# Altium project SNA.PrjPcb
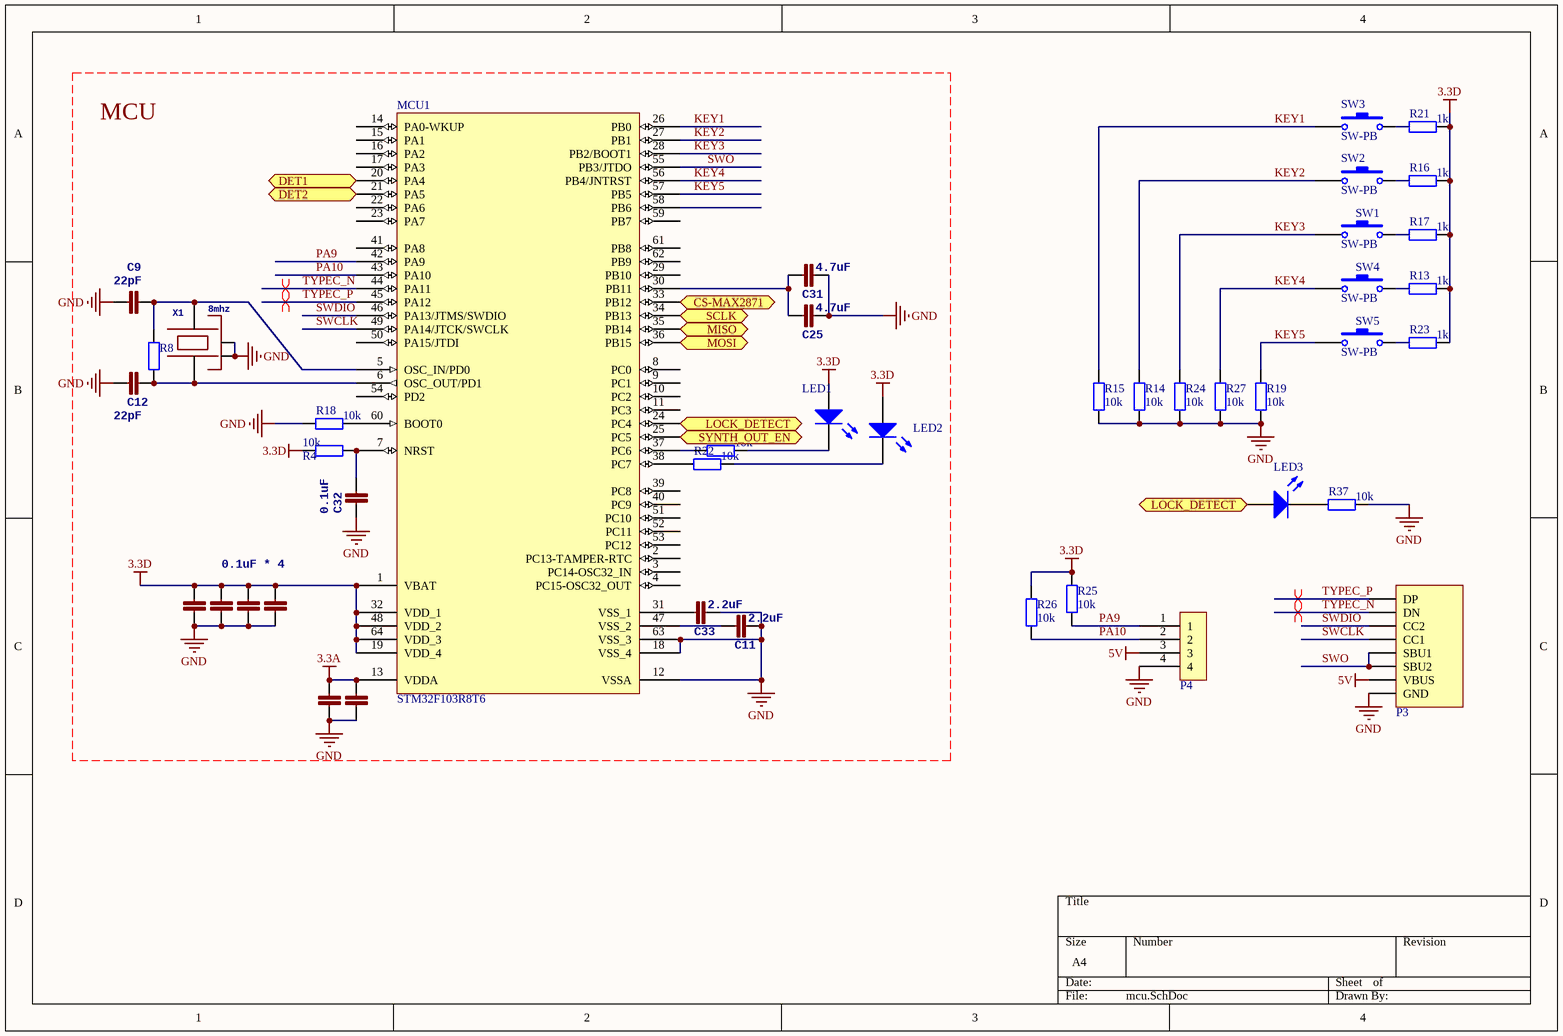
[diagram p0: mcu.SchDoc]
4 sheets, 135 parts. Net scope: flat (ports and power ports of the same name join across sheets).
Board file: SNA.PcbDoc
Sheets:
  mcu.SchDoc
  Detector.SchDoc
  source.SchDoc
  power.SchDoc

## Sheet mcu.SchDoc
size A4

### Parts
C3  1n  [0402]  (value not drawn)
C4  0.1uF * 4  [0402]
C5  1n  [0402]  (value not drawn)
C6  1n  [0402]  (value not drawn)
C7  1n  [0402]  (value not drawn)
C8  1n  [0402]  (value not drawn)
C9  22pF  [0402]
C11  2.2uF  [0603]
C12  22pF  [0402]
C25  4.7uF  [0603]
C31  4.7uF  [0603]
C32  0.1uF  [0402]
C33  2.2uF  [0603]
LED1  LED0  [0603]  (value not drawn)
LED2  LED0  [0603]  (value not drawn)
LED3  LED0  [0603]  (value not drawn)
MCU1  STM32F103R8T6  [LQFP64_N]
P3  USBC  [USBTC]  (value not drawn)
P4  UART/I2C  [4pSocket]  (value not drawn)
R4  10k  [0402]
R8  (no value)  [0402]
R13  1k  [0402]
R14  10k  [0402]
R15  10k  [0402]
R16  1k  [0402]
R17  1k  [0402]
R18  10k  [0402]
R19  10k  [0402]
R20  10k  [0402]
R21  1k  [0402]
R22  10k  [0402]
R23  1k  [0402]
R24  10k  [0402]
R25  10k  [0402]
R26  10k  [0402]
R27  10k  [0402]
R37  10k  [0402]
SW1  SW-PB  [SW3x4]
SW2  SW-PB  [SW3x4]
SW3  SW-PB  [SW3x4]
SW4  SW-PB  [SW3x4]
SW5  SW-PB  [SW3x4]
X1  8mhz  [OSCILLATOR-3.2X2.5]

### Ports
CS-MAX2871 (out), DET1, DET2, LOCK_DETECT, MISO, MOSI, SCLK (out), SYNTH_OUT_EN

### Nets
3.3A: C3.1 C8.1 MCU1.13(VDDA)
3.3D: C4.2 C5.2 C6.2 C7.2 LED1.1(A) LED2.1(A) MCU1.1(VBAT) MCU1.19(VDD_4) MCU1.32(VDD_1) MCU1.48(VDD_2) MCU1.64(VDD_3) R4.2 R13.2 R16.2 R17.2 R21.2 R23.2 R25.2 R26.2
5V: P3.VBUS P4.3
GND: C3.2 C4.1 C5.1 C6.1 C7.1 C8.2 C9.2 C11.2 C12.2 C25.2 C31.2 C32.1 C33.2 MCU1.12(VSSA) MCU1.18(VSS_4) MCU1.63(VSS_3) P3.GND P4.4 R14.1 R15.1 R18.1 R19.1 R24.1 R27.1 R37.2 X1.2(NC_2) X1.4(NC_4)
KEY1: MCU1.26(PB0) R15.2 SW3.1
KEY2: MCU1.27(PB1) R14.2 SW2.1
KEY3: MCU1.28(PB2/BOOT1) R24.2 SW1.1
KEY4: MCU1.56(PB4/JNTRST) R27.2 SW4.1
KEY5: MCU1.57(PB5) R19.2 SW5.1
PA9: MCU1.42(PA9) P4.1 R25.1
PA10: MCU1.43(PA10) P4.2 R26.1
SWCLK: MCU1.49(PA14/JTCK/SWCLK) P3.CC1
SWDIO: MCU1.46(PA13/JTMS/SWDIO) P3.CC2
SWO: MCU1.55(PB3/JTDO) P3.SBU1 P3.SBU2
TYPEC_N: MCU1.44(PA11) P3.DN
TYPEC_P: MCU1.45(PA12) P3.DP
NetC9_1: C9.1 MCU1.5(OSC_IN/PD0) R8.2 X1.3
NetC11_1: C11.1 MCU1.47(VSS_2)
NetC12_1: C12.1 MCU1.6(OSC_OUT/PD1) R8.1 X1.1
NetC25_1: C25.1 C31.1 MCU1.30(PB11)
NetC32_2: C32.2 MCU1.7(NRST) R4.1
NetC33_1: C33.1 MCU1.31(VSS_1)
NetLED1_2: LED1.2(K) R20.2
NetLED2_2: LED2.2(K) R22.2
NetLED3_1: LED3.1(A) MCU1.24(PC4) ; port LOCK_DETECT
NetLED3_2: LED3.2(K) R37.1
NetMCU1_20: MCU1.20(PA4) ; port DET1
NetMCU1_21: MCU1.21(PA5) ; port DET2
NetMCU1_25: MCU1.25(PC5) ; port SYNTH_OUT_EN
NetMCU1_33: MCU1.33(PB12) ; port CS-MAX2871
NetMCU1_34: MCU1.34(PB13) ; port SCLK
NetMCU1_35: MCU1.35(PB14) ; port MISO
NetMCU1_36: MCU1.36(PB15) ; port MOSI
NetMCU1_37: MCU1.37(PC6) R20.1
NetMCU1_38: MCU1.38(PC7) R22.1
NetMCU1_60: MCU1.60(BOOT0) R18.2
NetR13_1: R13.1 SW4.2
NetR16_1: R16.1 SW2.2
NetR17_1: R17.1 SW1.2
NetR21_1: R21.1 SW3.2
NetR23_1: R23.1 SW5.2

Not connected (* = marked no-connect by the designer): MCU1 2(PC13-TAMPER-RTC) 3(PC14-OSC32_IN) 4(PC15-OSC32_OUT) 8(PC0) 9(PC1) 10(PC2) 11(PC3) 14(PA0-WKUP) 15(PA1) 16(PA2) 17(PA3) 22(PA6) 23(PA7) 29(PB10) 39(PC8) 40(PC9) 41(PA8) 50(PA15/JTDI) 51(PC10) 52(PC11) 53(PC12) 54(PD2) 58(PB6) 59(PB7) 61(PB8) 62(PB9)

### Layout directives
differential pair: TYPEC_N, TYPEC_P

### Notes on the sheet
- MCU

### Library data of the parts
C3-C9 C11 C12 C25 C31-C33 = CAP0402-CAP: <b>Capacitor</b> / Standard 0603 ceramic capacitor, and 0.1" leaded capacitor.; PARTNO: CC0402ZRY5V7BB104
LED1-LED3 = LED0: Typical INFRARED GaAs LED; Published: 8-Jun-2000; LatestRevisionDate: 08-Jul-2005; LatestRevisionNote: Mech Layer 1 removed.; PackageReference: LED-0; Publisher: Altium Limited; PackageDescription: LED; 2 Leads
MCU1 = STM32F103R8T6: STM32 ARM-based 32-bit MCU with 64 Kbytes Flash, 64-pin LQFP, Industrial Temperature; Published: *; DatasheetVersion: *; PackageVersion: *; PackageReference: *; Publisher: *; PackageDescription: *; ComponentLink1Description: *; ComponentLink1URL: *; ComponentLink2Description: *; ComponentLink2URL: *
P4 = 4PSocket
R4 R8 R13-R27 R37 = Res2: Resistor; Value: 0Ohm; Published: 8-Jun-2000; LatestRevisionDate: 17-Jul-2002; LatestRevisionNote: Re-released for DXP Platform.; PackageReference: AXIAL-0.4; Publisher: Altium Limited; PackageDescription: Axial Device, Thru-Hole; 2 Leads; 0.4 in Pin Spacing
SW1-SW5 = SW-PB: Switch; Published: 24-Mar-1999; LatestRevisionDate: 17-Jul-2002; LatestRevisionNote: Re-released for DXP Platform.; PackageReference: SPST-2; Publisher: Altium Limited; PackageDescription: Switch; 2 Leads
X1 = OSCILLATOR-3.2X2.5: Crystal Oscillator in 3.2x2.5 SMD

## Sheet Detector.SchDoc
size A4
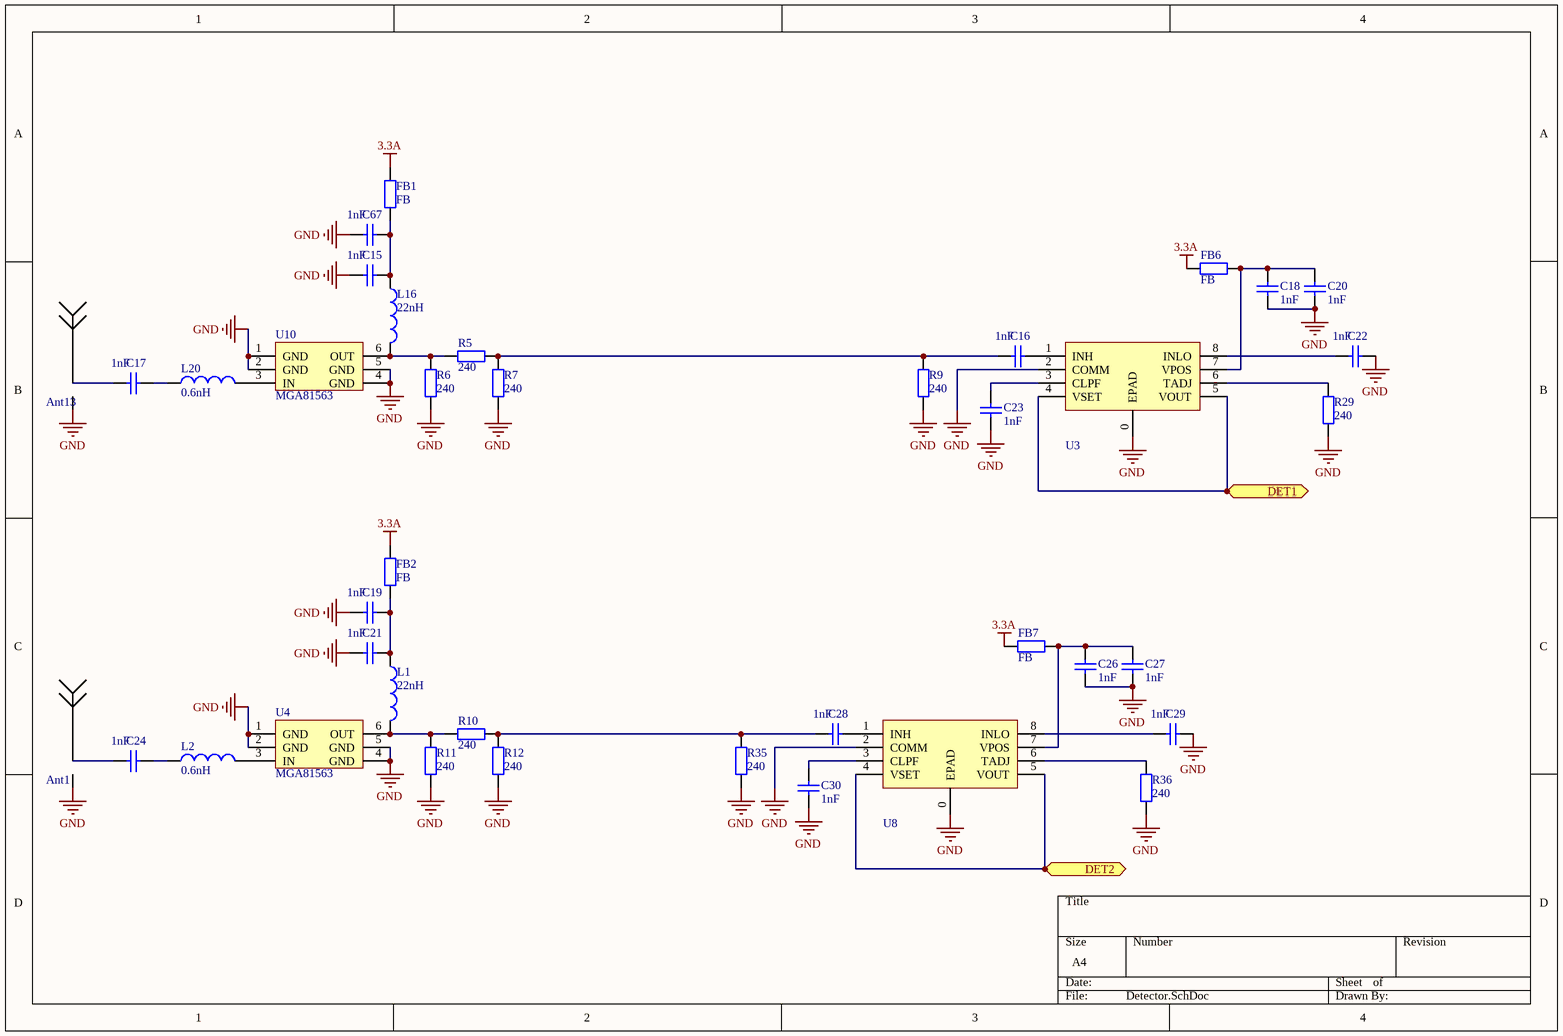
[diagram p1: Detector.SchDoc]

### Parts
Ant1  Antenna  [SMA-2]  (value not drawn)
Ant13  Antenna  [SMA-2]  (value not drawn)
C15  1nF  [0402]
C16  1nF  [0402]
C17  1nF  [0402]
C18  1nF  [0402]
C19  1nF  [0402]
C20  1nF  [0402]
C21  1nF  [0402]
C22  1nF  [0402]
C23  1nF  [0402]
C24  1nF  [0402]
C26  1nF  [0402]
C27  1nF  [0402]
C28  1nF  [0402]
C29  1nF  [0402]
C30  1nF  [0402]
C67  1nF  [0402]
FB1  FB  [0402]
FB2  FB  [0402]
FB6  FB  [0402]
FB7  FB  [0402]
L1  value 22nH  [0402]  (hidden comment: Inductor)
L2  value 0.6nH  [0402]  (hidden comment: Inductor)
L16  value 22nH  [0402]  (hidden comment: Inductor)
L20  value 0.6nH  [0402]  (hidden comment: Inductor)
R5  240  [0402]
R6  240  [0402]
R7  240  [0402]
R9  240  [0402]
R10  240  [0402]
R11  240  [0402]
R12  240  [0402]
R29  240  [0402]
R35  240  [0402]
R36  240  [0402]
U3  AD8319  [AD8319]  (value not drawn)
U4  MGA81563  [SC-70-6]
U8  AD8319  [AD8319]  (value not drawn)
U10  MGA81563  [SC-70-6]

### Ports
DET1, DET2

### Nets
3.3A: FB1.1 FB2.1 FB6.1 FB7.1
GND: Ant1.GND(G) Ant13.GND(G) C15.1 C18.1 C19.1 C20.1 C21.1 C22.2 C23.1 C26.1 C27.1 C29.2 C30.1 C67.1 R6.2 R7.2 R9.2 R11.2 R12.2 R29.2 R35.2 R36.2 U3.0(EPAD) U3.2(COMM) U4.1(GND) U4.2(GND) U4.4(GND) U4.5(GND) U8.0(EPAD) U8.2(COMM) U10.1(GND) U10.2(GND) U10.4(GND) U10.5(GND)
NetAnt1_1: Ant1.1 C24.1
NetAnt13_1: Ant13.1 C17.1
NetC15_2: C15.2 C67.2 FB1.2 L16.1
NetC16_1: C16.1 R5.2 R7.1 R9.1
NetC16_2: C16.2 U3.1(INH)
NetC17_2: C17.2 L20.1
NetC18_2: C18.2 C20.2 FB6.2 U3.7(VPOS)
NetC19_2: C19.2 C21.2 FB2.2 L1.1
NetC22_1: C22.1 U3.8(INLO)
NetC23_2: C23.2 U3.3(CLPF)
NetC24_2: C24.2 L2.1
NetC26_2: C26.2 C27.2 FB7.2 U8.7(VPOS)
NetC28_1: C28.1 R10.2 R12.1 R35.1
NetC28_2: C28.2 U8.1(INH)
NetC29_1: C29.1 U8.8(INLO)
NetC30_2: C30.2 U8.3(CLPF)
NetL1_2: L1.2 R10.1 R11.1 U4.6(OUT)
NetL2_2: L2.2 U4.3(IN)
NetL16_2: L16.2 R5.1 R6.1 U10.6(OUT)
NetL20_2: L20.2 U10.3(IN)
NetMCU1_20: U3.4(VSET) U3.5(VOUT) ; port DET1
NetMCU1_21: U8.4(VSET) U8.5(VOUT) ; port DET2
NetR29_1: R29.1 U3.6(TADJ)
NetR36_1: R36.1 U8.6(TADJ)

### Library data of the parts
C15-C24 C26-C30 C67 = Cap: Capacitor; Published: 8-Jun-2000; LatestRevisionDate: 17-Jul-2002; LatestRevisionNote: Re-released for DXP Platform.; PackageReference: RAD-0.3; Publisher: Altium Limited; PackageDescription: Radial Cap, Thru-Hole; 2 Leads; 0.3 in Pin Spacing
FB1 FB2 FB6 FB7 R5-R7 R9-R12 R29 R35 R36 = Res2: Resistor; Published: 8-Jun-2000; LatestRevisionDate: 17-Jul-2002; LatestRevisionNote: Re-released for DXP Platform.; PackageReference: AXIAL-0.4; Publisher: Altium Limited; PackageDescription: Axial Device, Thru-Hole; 2 Leads; 0.4 in Pin Spacing
L1 L2 L16 L20 = Inductor: Code_IEC: 1005; Published: 8-Jun-2000; LatestRevisionDate: 29-May-2009; LatestRevisionNote: IPC-7351 Footprint Added.; PackageReference: 0402-A; Publisher: Altium Limited; PackageDescription: Chip Inductor; Code_JEITA: 0402

## Sheet source.SchDoc
size A4
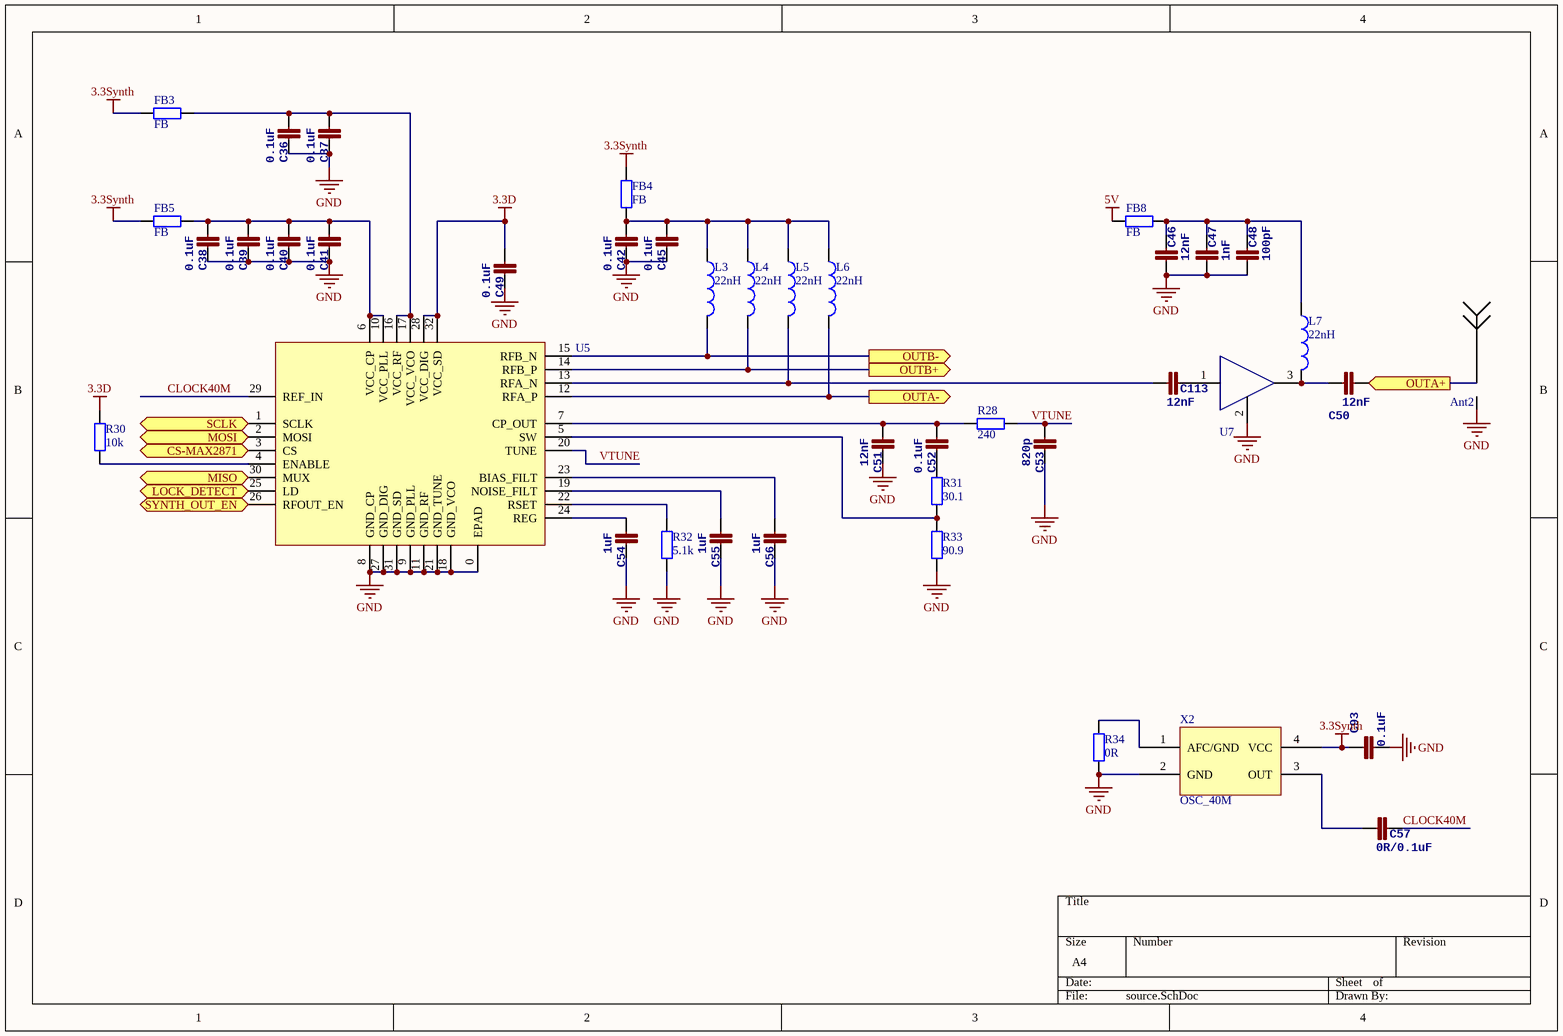
[diagram p2: source.SchDoc]

### Parts
Ant2  Antenna  [SMA-2]  (value not drawn)
C36  0.1uF  [0402]
C37  0.1uF  [0402]
C38  0.1uF  [0402]
C39  0.1uF  [0402]
C40  0.1uF  [0402]
C41  0.1uF  [0402]
C42  0.1uF  [0402]
C45  0.1uF  [0402]
C46  12nF  [0805]
C47  1nF  [0402]
C48  100pF  [0402]
C49  0.1uF  [0402]
C50  12nF  [0402]
C51  12nF  [0402]
C52  0.1uF  [0402]
C53  820p  [0402]
C54  1uF  [0402]
C55  1uF  [0402]
C56  1uF  [0402]
C57  0R/0.1uF  [0402]
C93  0.1uF  [0402]
C113  12nF  [0402]
FB3  FB  [0603]
FB4  FB  [0603]
FB5  FB  [0603]
FB8  FB  [0603]
L3  value 22nH  [0402]  (hidden comment: Inductor)
L4  value 22nH  [0402]  (hidden comment: Inductor)
L5  value 22nH  [0402]  (hidden comment: Inductor)
L6  value 22nH  [0402]  (hidden comment: Inductor)
L7  value 22nH  [0603]  (hidden comment: Inductor)
R28  240  [0402]
R30  10k  [0402]
R31  30.1  [0402]
R32  5.1k  [0402]
R33  90.9  [0402]
R34  0R  [0402]
U5  MAX2871  [MAX2871]  (value not drawn)
U7  AMP-SOT89  [SOT-89]  (value not drawn)
X2  OSC_40M  [TXC_7Q]

### Ports
CS-MAX2871 (in), LOCK_DETECT, MISO, MOSI, OUTA+ (out), OUTA- (out), OUTB+ (out), OUTB- (out), SCLK (in), SYNTH_OUT_EN

### Nets
3.3D: C49.1 R30.2 U5.28(VCC_DIG) U5.32(VCC_SD)
3.3Synth: C93.1 FB3.2 FB4.1 FB5.2 X2.4(VCC)
5V: FB8.1
GND: Ant2.GND(G) C36.2 C37.2 C38.2 C39.2 C40.2 C41.2 C42.2 C45.2 C46.1 C47.1 C48.1 C49.2 C51.2 C53.2 C54.2 C55.2 C56.2 C93.2 R32.1 R33.1 R34.2 U5.0(EPAD) U5.8(GND_CP) U5.9(GND_PLL) U5.11(GND_RF) U5.18(GND_VCO) U5.21(GND_TUNE) U5.27(GND_DIG) U5.31(GND_SD) U7.2 X2.2(GND)
CLOCK40M: C57.2 U5.29(REF_IN)
VTUNE: C53.1 R28.1 U5.20(TUNE)
NetAnt2_1: Ant2.1 C50.2 ; port OUTA+
NetC36_1: C36.1 C37.1 FB3.1 U5.16(VCC_RF) U5.17(VCC_VCO)
NetC38_1: C38.1 C39.1 C40.1 C41.1 FB5.1 U5.6(VCC_CP) U5.10(VCC_PLL)
NetC42_1: C42.1 C45.1 FB4.2 L3.1 L4.1 L5.1 L6.1
NetC46_2: C46.2 C47.2 C48.2 FB8.2 L7.1
NetC50_1: C50.1 L7.2 U7.3
NetC51_1: C51.1 C52.1 R28.2 U5.7(CP_OUT)
NetC52_2: C52.2 R31.2
NetC54_1: C54.1 U5.24(REG)
NetC55_1: C55.1 U5.19(NOISE_FILT)
NetC56_1: C56.1 U5.23(BIAS_FILT)
NetC57_1: C57.1 X2.3(OUT)
NetC113_1: C113.1 L5.2 U5.13(RFA_N)
NetC113_2: C113.2 U7.1
NetL3_2: L3.2 U5.15(RFB_N) ; port OUTB-
NetL4_2: L4.2 U5.14(RFB_P) ; port OUTB+
NetL6_2: L6.2 U5.12(RFA_P) ; port OUTA-
NetLED3_1: U5.25(LD) ; port LOCK_DETECT
NetMCU1_25: U5.26(RFOUT_EN) ; port SYNTH_OUT_EN
NetMCU1_33: U5.3(CS) ; port CS-MAX2871
NetMCU1_34: U5.1(SCLK) ; port SCLK
NetMCU1_35: U5.30(MUX) ; port MISO
NetMCU1_36: U5.2(MOSI) ; port MOSI
NetR30_1: R30.1 U5.4(ENABLE)
NetR31_1: R31.1 R33.2 U5.5(SW)
NetR32_2: R32.2 U5.22(RSET)
NetR34_1: R34.1 X2.1(AFC/GND)

### Library data of the parts
C36-C42 C45-C57 C93 C113 = CAP0402-CAP: as C3 on sheet mcu
FB3-FB5 FB8 R28 R30-R33 = Res2: Resistor; Published: 8-Jun-2000; LatestRevisionDate: 17-Jul-2002; LatestRevisionNote: Re-released for DXP Platform.; PackageReference: AXIAL-0.4; Publisher: Altium Limited; PackageDescription: Axial Device, Thru-Hole; 2 Leads; 0.4 in Pin Spacing
L3-L7 = Inductor: Code_IEC: 1005; Published: 8-Jun-2000; LatestRevisionDate: 29-May-2009; LatestRevisionNote: IPC-7351 Footprint Added.; PackageReference: 0402-A; Publisher: Altium Limited; PackageDescription: Chip Inductor; Code_JEITA: 0402
R34 = Res2: Resistor; Value: 0Ohm; Published: 8-Jun-2000; LatestRevisionDate: 17-Jul-2002; LatestRevisionNote: Re-released for DXP Platform.; PackageReference: AXIAL-0.4; Publisher: Altium Limited; PackageDescription: Axial Device, Thru-Hole; 2 Leads; 0.4 in Pin Spacing

## Sheet power.SchDoc
size A4
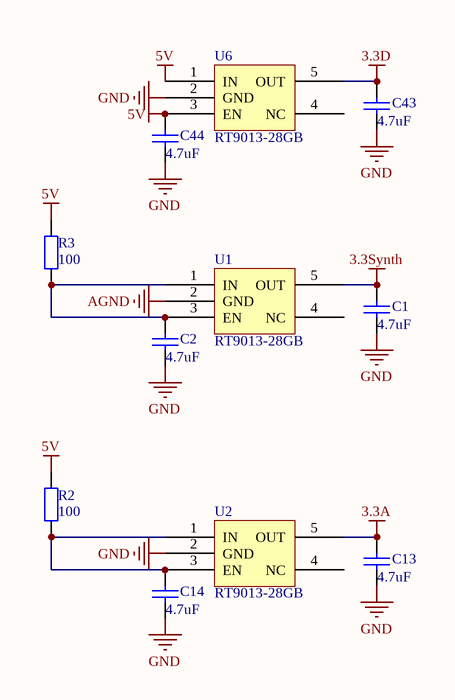
[diagram p3: power.SchDoc]

### Parts
C1  4.7uF  [0603]
C2  4.7uF  [0603]
C13  4.7uF  [0603]
C14  4.7uF  [0603]
C43  4.7uF  [0603]
C44  4.7uF  [0603]
R2  100  [0603]
R3  100  [0603]
U1  RT9013-28GB  [SOT23-5]
U2  RT9013-28GB  [SOT23-5]
U6  RT9013-28GB  [SOT23-5]

### Nets
3.3A: C13.2 U2.5(OUT)
3.3D: C43.2 U6.5(OUT)
3.3Synth: C1.2 U1.5(OUT)
5V: C44.2 R2.2 R3.2 U6.1(IN) U6.3(EN)
AGND: U1.2(GND)
GND: C1.1 C2.1 C13.1 C14.1 C43.1 C44.1 U2.2(GND) U6.2(GND)
NetC2_2: C2.2 R3.1 U1.1(IN) U1.3(EN)
NetC14_2: C14.2 R2.1 U2.1(IN) U2.3(EN)

Not connected (* = marked no-connect by the designer): U1 4(NC); U2 4(NC); U6 4(NC)

### Library data of the parts
C1 C2 C13 C14 C43 C44 = Cap: Capacitor; Published: 8-Jun-2000; LatestRevisionDate: 17-Jul-2002; LatestRevisionNote: Re-released for DXP Platform.; PackageReference: RAD-0.3; Publisher: Altium Limited; PackageDescription: Radial Cap, Thru-Hole; 2 Leads; 0.3 in Pin Spacing
R2 R3 = Res2: Resistor; Value: 0Ohm; Published: 8-Jun-2000; LatestRevisionDate: 17-Jul-2002; LatestRevisionNote: Re-released for DXP Platform.; PackageReference: AXIAL-0.4; Publisher: Altium Limited; PackageDescription: Axial Device, Thru-Hole; 2 Leads; 0.4 in Pin Spacing
U1 U2 U6 = LP5907

## Nets that join several sheets
3.3A: mcu (C3.1 C8.1 MCU1.13), Detector (FB1.1 FB2.1 FB6.1 FB7.1), power (C13.2 U2.5)
3.3D: mcu (19 pins), source (C49.1 R30.2 U5.28 U5.32), power (C43.2 U6.5)
3.3Synth: source (5 pins), power (C1.2 U1.5)
5V: mcu (P3.VBUS P4.3), source (FB8.1), power (5 pins)
GND: mcu (27 pins), Detector (34 pins), source (32 pins), power (8 pins)
NetLED3_1: mcu (LED3.1 MCU1.24), source (U5.25)
NetMCU1_20: mcu (MCU1.20), Detector (U3.4 U3.5)
NetMCU1_21: mcu (MCU1.21), Detector (U8.4 U8.5)
NetMCU1_25: mcu (MCU1.25), source (U5.26)
NetMCU1_33: mcu (MCU1.33), source (U5.3)
NetMCU1_34: mcu (MCU1.34), source (U5.1)
NetMCU1_35: mcu (MCU1.35), source (U5.30)
NetMCU1_36: mcu (MCU1.36), source (U5.2)